# Altium schematic sheet ST_LINK_V2-1.SchDoc: ST_LINK_V2-1
size A4; CompanyName: STMicroelectronics; Organization: Microcontrollers Division; SheetNumber: 7; SheetTotal: 8
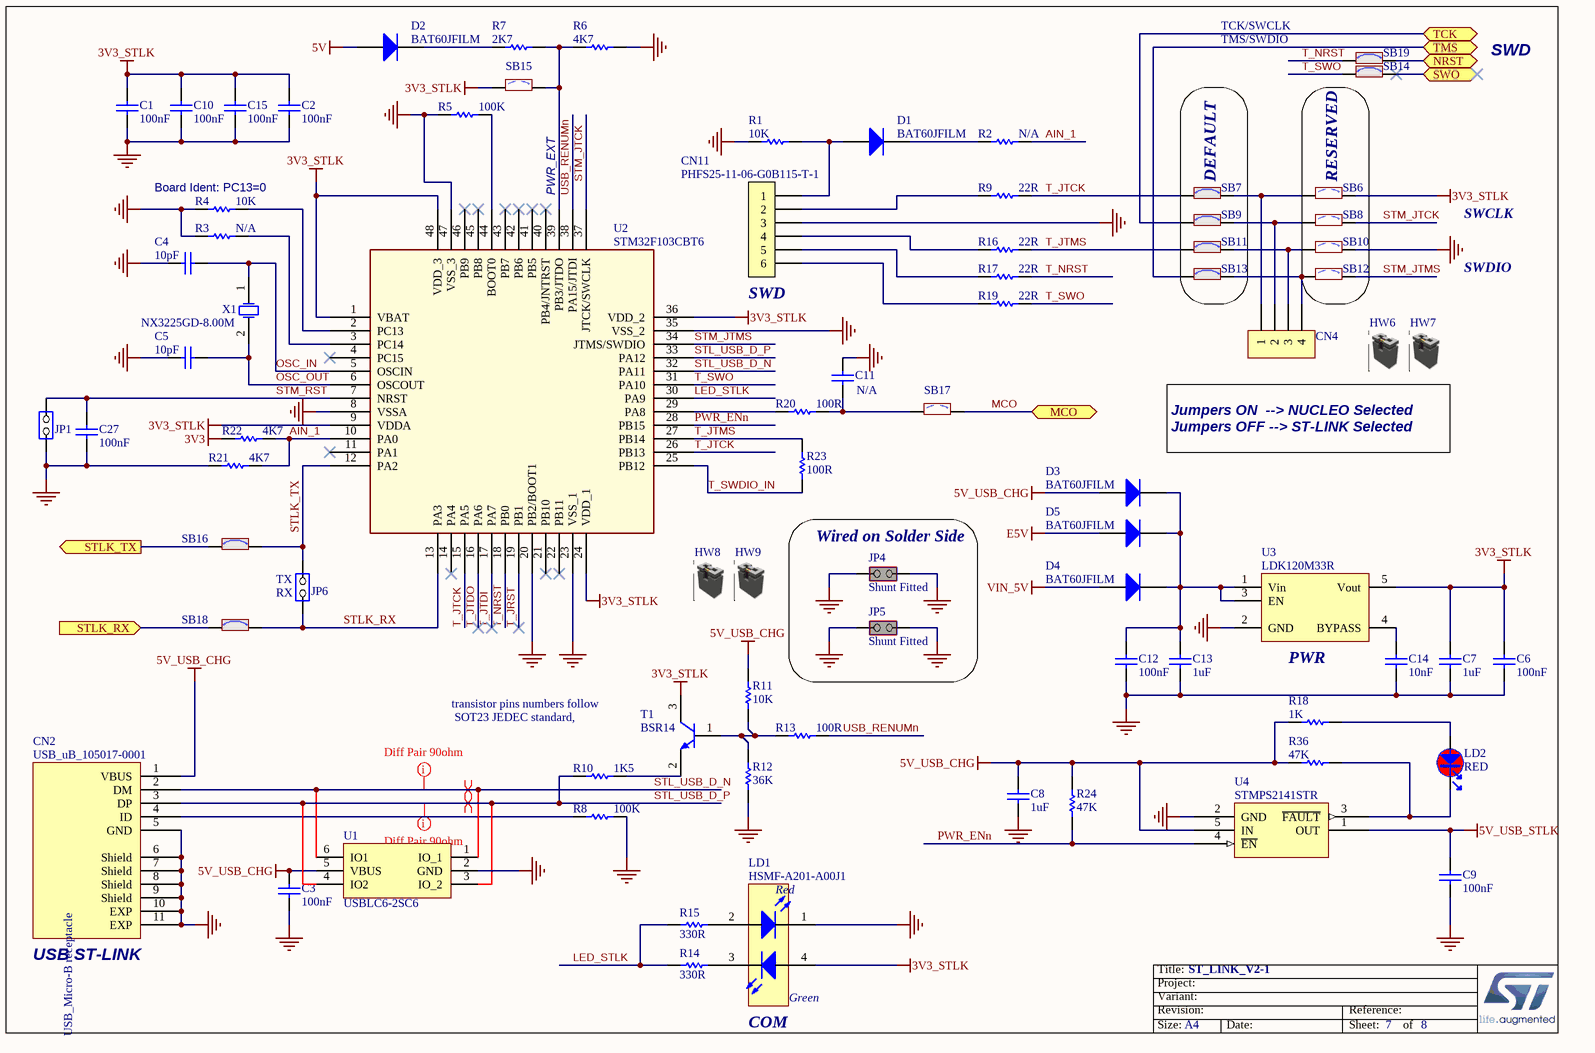
[diagram p0: ST_LINK_V2-1.SchDoc]

## Parts
C1  value 100nF  [C0603]  (hidden comment: Capacitor)
C2  value 100nF  [C0603]  (hidden comment: Capacitor)
C3  value 100nF  [C0603]  (hidden comment: Capacitor)
C4  value 10pF  [C0603]  (hidden comment: Capacitor)
C5  value 10pF  [C0603]  (hidden comment: Capacitor)
C6  value 100nF  [C0603]  (hidden comment: Capacitor)
C7  value 1uF  [C0603]  (hidden comment: Capacitor)
C8  value 1uF  [C0603]  (hidden comment: Capacitor)
C9  value 100nF  [C0603]  (hidden comment: Capacitor)
C10  value 100nF  [C0603]  (hidden comment: Capacitor)
C11  N/A  [C0603]
C12  value 100nF  [C0603]  (hidden comment: Capacitor)
C13  value 1uF  [C0603]  (hidden comment: Capacitor)
C14  value 10nF  [C0603]  (hidden comment: Capacitor)
C15  value 100nF  [C0603]  (hidden comment: Capacitor)
C27  value 100nF  [C0603]  (hidden comment: Capacitor)
CN2  value USB_uB_105017-0001  [CON_USBMICROB_MOLEX_105017-0001_H2P90]  (hidden comment: USB_uB_105017.0001)
CN4  Header 4x1  [CON_988-JIUBABA_PHFS25-11-04-G0B115-T-1]  (value not drawn)
CN11  Manufacturer_Part_Number: PHFS25-11-06-G0B115-T-1  [CON_988-JIUBABA_PHFS25-11-06-G0B115-T-1]  (hidden comment: Header 6x1)
D1  BAT60JFILM  [DIO_SOD323]
D2  BAT60JFILM  [DIO_SOD323]
D3  BAT60JFILM  [DIO_SOD323]
D4  BAT60JFILM  [DIO_SOD323]
D5  BAT60JFILM  [DIO_SOD323]
HW6  Shunt 2.54mm  [N/A]  (value not drawn)  (mechanical)
HW7  Shunt 2.54mm  [N/A]  (value not drawn)  (mechanical)
HW8  Shunt 2.54mm  [N/A]  (value not drawn)  (mechanical)
HW9  Shunt 2.54mm  [N/A]  (value not drawn)  (mechanical)
JP1  Jumper Header 2x1  [CON_SAMTEC_TSW-102-07-G-S]  (value not drawn)
JP4  Shunt Fitted  [CON_SAMTEC_TSW-102-07-G-S]
JP5  Shunt Fitted  [CON_SAMTEC_TSW-102-07-G-S]
JP6  Jumper Header 2x1  [CON_SAMTEC_TSW-102-07-G-S]  (value not drawn)
LD1  Manufacturer_Part_Number: HSMF-A201-A00J1  [LED_BI-GR_HSMF-A201-A00J1]  (hidden comment: LD_BICOLOR_CMS)
LD2  value RED  [LED_0603_RED]  (hidden comment: LED_red)
R1  value 10K  [R0603]  (hidden comment: Resistor)
R2  N/A  [R0603]
R3  N/A  [R0603]
R4  value 10K  [R0603]  (hidden comment: Resistor)
R5  value 100K  [R0603]  (hidden comment: Resistor)
R6  value 4K7  [R0603]  (hidden comment: Resistor)
R7  value 2K7  [R0603]  (hidden comment: Resistor)
R8  value 100K  [R0603]  (hidden comment: Resistor)
R9  value 22R  [R0603]  (hidden comment: Resistor)
R10  value 1K5  [R0603]  (hidden comment: Resistor)
R11  value 10K  [R0603]  (hidden comment: Resistor)
R12  value 36K  [R0603]  (hidden comment: Resistor)
R13  value 100R  [R0603]  (hidden comment: Resistor)
R14  value 330R  [R0603]  (hidden comment: Resistor)
R15  value 330R  [R0603]  (hidden comment: Resistor)
R16  value 22R  [R0603]  (hidden comment: Resistor)
R17  value 22R  [R0603]  (hidden comment: Resistor)
R18  value 1K  [R0603]  (hidden comment: Resistor)
R19  value 22R  [R0603]  (hidden comment: Resistor)
R20  value 100R  [R0603]  (hidden comment: Resistor)
R21  value 4K7  [R0603]  (hidden comment: Resistor)
R22  value 4K7  [R0603]  (hidden comment: Resistor)
R23  value 100R  [R0603]  (hidden comment: Resistor)
R24  value 47K  [R0603]  (hidden comment: Resistor)
R36  value 47K  [R0603]  (hidden comment: Resistor)
SB6  SB_OFF  [SOLDER-BRIDGE_R0603-0R]  (value not drawn)
SB7  SB_ON  [SOLDER-BRIDGE_R0603-0R]  (value not drawn)
SB8  SB_OFF  [SOLDER-BRIDGE_R0603-0R]  (value not drawn)
SB9  SB_ON  [SOLDER-BRIDGE_R0603-0R]  (value not drawn)
SB10  SB_OFF  [SOLDER-BRIDGE_R0603-0R]  (value not drawn)
SB11  SB_ON  [SOLDER-BRIDGE_R0603-0R]  (value not drawn)
SB12  SB_OFF  [SOLDER-BRIDGE_R0603-0R]  (value not drawn)
SB13  SB_ON  [SOLDER-BRIDGE_R0603-0R]  (value not drawn)
SB14  SB_ON  [SOLDER-BRIDGE_R0603-0R]  (value not drawn)
SB15  SB_OFF  [SOLDER-BRIDGE_R0603-0R]  (value not drawn)
SB16  SB_ON  [SOLDER-BRIDGE_R0603-0R]  (value not drawn)
SB17  SB_OFF  [SOLDER-BRIDGE_R0603-0R]  (value not drawn)
SB18  SB_ON  [SOLDER-BRIDGE_R0603-0R]  (value not drawn)
SB19  SB_ON  [SOLDER-BRIDGE_R0603-0R]  (value not drawn)
T1  Manufacturer_Part_Number: BSR14  [NPN_SOT23]  (hidden comment: 9013-SOT23)
U1  USBLC6-2SC6  [ESD_SOT23-6L]
U2  STM32F103CBT6  [ICC_LQFP48_7X7_P050]
U3  LDK120M33R  [REG_SOT23-5L]
U4  value STMPS2141STR  [MOS_SOT23-5L]  (hidden comment: DFN8 and SO8 are mixed in a single footprint allowing to swap according to components availability)
X1  value NX3225GD-8.00M  [CRY_NX3225GD_2P]  (hidden comment: XTAL_8M_NX3225GD)

## Blocks framed on the sheet
DEFAULT: SB7 SB9 SB11 SB13
RESERVED: SB6 SB8 SB10 SB12
Wired on Solder Side: JP4 JP5

## Ports
MCO, NRST, STLK_RX (in), STLK_TX (out), SWO, TCK, TMS

## Nets
3V3: R22.1
3V3_STLK: C1.2 C2.2 C6.2 C7.2 C10.2 C15.2 LD1.4(YellowGreen_anode) SB6.2 SB15.1 T1.3(C) U2.1(VBAT) U2.9(VDDA) U2.24(VDD_1) U2.36(VDD_2) U2.48(VDD_3) U3.5(Vout)
5V: D2.1(A)
5V_USB_CHG: C3.2 C8.1 CN2.1(VBUS) D3.1(A) R11.2 R18.2 R24.2 R36.2 U1.5(VBUS) U4.5(IN)
5V_USB_STLK: C9.2 U4.1(OUT)
E5V: D5.1(A)
GND: C1.1 C2.1 C3.1 C4.1 C5.1 C6.1 C7.1 C8.2 C9.1 C10.1 C11.2 C12.1 C13.1 C14.1 C15.1 C27.2 CN2.5(GND) CN2.6(Shield) CN2.7(Shield) CN2.8(Shield) CN2.9(Shield) CN2.10(EXP) CN2.11(EXP) CN11.3 JP1.2(NO) JP4.1(COMMON) JP4.2(NO) JP5.1(COMMON) JP5.2(NO) LD1.1(RED_cathode) R1.2 R3.1 R4.1 R5.1 R6.2 R8.2 R12.1 R21.1 SB10.2 U1.2(GND) U2.8(VSSA) U2.20(PB2/BOOT1) U2.23(VSS_1) U2.35(VSS_2) U2.47(VSS_3) U3.2(GND) U4.2(GND)
VIN_5V: D4.1(A)
AIN_1: R2.2 R21.2 R22.2 U2.10(PA0)
LED_STLK: R14.1 R15.1 U2.30(PA9)
MCO: SB17.2 ; port MCO
NRST: SB19.2 ; port NRST
OSC_IN: C4.2 U2.5(OSCIN) X1.1(OSC1)
OSC_OUT: C5.2 U2.6(OSCOUT) X1.2(OSC2)
PWR_ENn: R24.1 U2.28(PB15) U4.4(~{EN})
STL_USB_D_N: CN2.2(DM) U1.1(IO_1) U1.6(IO1) U2.32(PA11)
STL_USB_D_P: CN2.3(DP) R10.1 U1.3(IO_2) U1.4(IO2) U2.33(PA12)
STLK_RX: JP6.1(COMMON) SB18.2 U2.13(PA3)
STLK_RX: SB18.1 ; port STLK_RX  [a separate net that carries the same name]
STLK_TX: JP6.2(NO) SB16.2 U2.12(PA2)
STLK_TX: SB16.1 ; port STLK_TX  [a separate net that carries the same name]
STM_JTCK: SB8.2 U2.37(JTCK/SWCLK)
STM_JTMS: SB12.2 U2.34(JTMS/SWDIO)
STM_RST: C27.1 JP1.1(COMMON) U2.7(NRST)
SWO: SB14.2 ; port SWO
T_JRST: U2.19(PB1)
T_JTCK: R9.2 SB7.1 U2.15(PA5) U2.26(PB13)
T_JTDI: U2.17(PA7)
T_JTDO: U2.16(PA6)
T_JTMS: R16.2 R23.2 SB11.1 U2.27(PB14)
T_NRST: R17.2 SB19.1 U2.18(PB0)
T_SWDIO_IN: R23.1 U2.25(PB12)
T_SWO: R19.2 SB14.1 U2.31(PA10)
TCK: SB9.1 ; port TCK
TMS: SB13.1 ; port TMS
USB_RENUMn: R13.2 U2.38(PA15/JTDI)
NetC11_1: C11.1 R20.2 SB17.1
NetC12_2: C12.2 C13.2 D3.2(K) D4.2(K) D5.2(K) U3.1(Vin) U3.3(EN)
NetC14_2: C14.2 U3.4(BYPASS)
NetCN2_4: CN2.4(ID) R8.1
NetCN4_1: CN4.1 SB6.1 SB7.2
NetCN4_2: CN4.2 SB8.1 SB9.2
NetCN4_3: CN4.3 SB10.1 SB11.2
NetCN4_4: CN4.4 SB12.1 SB13.2
NetCN11_1: CN11.1 D1.1(A) R1.1
NetCN11_2: CN11.2 R9.1
NetCN11_4: CN11.4 R16.1
NetCN11_5: CN11.5 R17.1
NetCN11_6: CN11.6 R19.1
NetD1_2: D1.2(K) R2.1
NetD2_2: D2.2(K) R7.1
NetLD1_2: LD1.2(Red_anode) R15.2
NetLD1_3: LD1.3(YellowGreen_cathode) R14.2
NetLD2_1: LD2.1 R18.1
NetLD2_2: LD2.2 R36.1 U4.3(~{FAULT})
NetR3_2: R3.2 U2.3(PC14)
NetR4_2: R4.2 U2.2(PC13)
NetR5_2: R5.2 U2.44(BOOT0)
NetR6_1: R6.1 R7.2 SB15.2 U2.39(PB3/JTDO)
NetR10_2: R10.2 T1.2(E)
NetR11_1: R11.1 R12.2 R13.1 T1.1(B)
NetR20_1: R20.1 U2.29(PA8)

Not connected (* = marked no-connect by the designer): U2 4(PC15)* 11(PA1)* 14(PA4)* 21(PB10)* 22(PB11)* 40(PB4/JNTRST)* 41(PB5)* 42(PB6)* 43(PB7)* 45(PB8)* 46(PB9)*

## Layout directives
mark named Diff Pair 90ohm: STL_USB_D_N, STL_USB_D_P
differential pair: STL_USB_D_N, STL_USB_D_P

## Notes on the sheet
- TCK/SWCLK
- TMS/SWDIO
- SWD
- (near R4) Board Ident: PC13=0
- PWR_EXT
- SWCLK
- (near CN11) SWD
- SWDIO
- Jumpers ON  --> NUCLEO Selected
  Jumpers OFF --> ST-LINK Selected
- (near JP6) TX
- (near JP6) RX
- (near U3) PWR
- (near T1) transistor pins numbers follow
  SOT23 JEDEC standard,
- (near CN2) USB ST-LINK
- COM
- Title:
- Project:
- Size:
- Revision:
- Variant:
- A4
- Date:
- Reference:
- Sheet:
- of
- (in symbol MCD-00028) USB_Micro-B receptacle
- (in symbol MCD-00051) Red; Green

## Library data of the parts
C1-C3 C6 C9 C10 C12 C15 C27 = MCD-00211: Capacitor, MLCC, 100nF, 16V, X7R, 10%, 0603, T=0,8mm; Manufacturer_Part_Number: CC0603KRX7R7BB104; Manufacturer: YAGEO; Provided_By: Subcon; Initial_Board_Reference: mb1319; Internal_Part_Number: MCD-00211; Status: Released; Part_Type: Capacitor; Package: C0603; ComponentLink1Description: Yageo_Capacitor_X7R-series.pdf; ComponentLink1URL: http://tunmcdsvn.tun.st.com/Component_Datasheet_Library/Trunk/Capacitors/Yageo_Capacitor_X7R-series.pdf; ECCN_US: n/a; ECCN_EU: n/a
C4 C5 = MCD-00637: Capacitor, MLCC, 10pF, 50V, NPO, 5%, 0603, T=0,8mm; Manufacturer_Part_Number: CC0603JRNPO9BN100; Manufacturer: YAGEO; Provided_By: subcon; Initial_Board_Reference: mb1319; Internal_Part_Number: MCD-00637; Status: Released; Part_Type: Capacitor; Package: C0603; ComponentLink1Description: Yageo_Capacitor_NP0_16V-to-50V.pdf; ComponentLink1URL: http://tunmcdsvn.tun.st.com/Component_Datasheet_Library/Trunk/Capacitors/Yageo_Capacitor_NP0_16V-to-50V.pdf; ECCN_US: n/a; ECCN_EU: n/a
C7 C13 = MCD-00010: Capacitor, MLCC, 1uF, 16V, X5R, 10%, 0603, T=0,8mm; Manufacturer_Part_Number: CC0603KRX5R7BB105; Manufacturer: YAGEO; Provided_By: Subcon; Initial_Board_Reference: mb1274; Internal_Part_Number: MCD-00010; Status: Released; Part_Type: Capacitor; Package: C0603; ComponentLink1Description: Yageo_Capacitor_X5R-series.pdf; ComponentLink1URL: http://tunmcdsvn.tun.st.com/Component_Datasheet_Library/Trunk/Capacitors/Yageo_Capacitor_X5R-series.pdf; ECCN_US: n/a; ECCN_EU: n/a
C8 = MCD-00238: Capacitor, MLCC, 1uF, 6V3, X5R, 10%, 0603, T=0,8mm; Manufacturer_Part_Number: CC0603KRX5R5BB105; Manufacturer: YAGEO; Provided_By: Subcon; Initial_Board_Reference: mb1319; Internal_Part_Number: MCD-00238; ECCN_US: n/a; ECCN_EU: n/a; ComponentLink1Description: Yageo_Capacitor_X5R-series.pdf; Status: Released; Part_Type: Capacitor; Package: C0603; ComponentLink1URL: http://tunmcdsvn.tun.st.com/Component_Datasheet_Library/Trunk/Capacitors/Yageo_Capacitor_X5R-series.pdf
C11 = MCD-00638: Capacitor, MLCC, 20pF, 50V, NPO, 5%, 0603, T=0,8mm; Manufacturer_Part_Number: CC0603JRNPO9BN200; Manufacturer: YAGEO; Provided_By: Subcon; Initial_Board_Reference: mb1319; Internal_Part_Number: MCD-00638; Value: 20pF; Status: Released; Part_Type: Capacitor; Package: C0603; ComponentLink1Description: Yageo_Capacitor_NP0_16V-to-50V.pdf; ECCN_US: n/a; ECCN_EU: n/a; ComponentLink1URL: http://tunmcdsvn.tun.st.com/Component_Datasheet_Library/Trunk/Capacitors/Yageo_Capacitor_NP0_16V-to-50V.pdf
C14 = MCD-00017: Capacitor, MLCC, 10nF, 50V, X7R, 10%, 0603, T=0.8mm; Manufacturer_Part_Number: CC0603KRX7R9BB103; Manufacturer: YAGEO; Provided_By: Subcon; Initial_Board_Reference: mb1274; Internal_Part_Number: MCD-00017; Status: Released; Part_Type: Capacitor; Package: C0603; ComponentLink1Description: Yageo_Capacitor_X7R-series.pdf; ComponentLink1URL: http://tunmcdsvn.tun.st.com/Component_Datasheet_Library/Trunk/Capacitors/Yageo_Capacitor_X7R-series.pdf; ECCN_US: n/a; ECCN_EU: n/a
CN2 = MCD-00028: USB-MICRO-B, 0.65mm, RA, SMT, Bottom Mount,; Part_Type: Connector; Manufacturer_Part_Number: 1050170001; Manufacturer: MOLEX; Provided_By: Subcon; Initial_Board_Reference: mb1274; Internal_Part_Number: MCD-00028; Status: Released; ComponentLink1Description: Molex_Connector-USB-microB_105017-0001.pdf; ComponentLink1URL: http://tunmcdsvn.tun.st.com/Component_Datasheet_Library/Trunk/Connectors/Molex_Connector-USB-microB_105017-0001.pdf; ECCN_US: n/a; ECCN_EU: n/a
CN4 = MCD-00313: Header, 4x1, 2.54mm, VR, TH, Height 6mm/3mm; Part_Type: Connector; Manufacturer_Part_Number: PHFS25-11-04-G0B115-T-1; Manufacturer: JIUBABA; Provided_By: Subcon; Initial_Board_Reference: mb1311; Internal_Part_Number: MCD-00313; Value: Header 4x1; Status: Released; ComponentLink1Description: Juibaba_PHFS25-11XXXXXXXXXX.pdf; ComponentLink1URL: http://tunmcdsvn.tun.st.com/Component_Datasheet_Library/Trunk/Connectors/Juibaba_PHFS25-11XXXXXXXXXX.pdf; ECCN_US: n/a; ECCN_EU: n/a
CN11 = MCD-00316: Header, 6x1, 2.54mm, VR, TH, Height 6mm/3mm; Part_Type: Connector; Manufacturer: JIUBABA; Value: Header 1x6; Provided_By: Subcon; Initial_Board_Reference: mb1311; Internal_Part_Number: MCD-00316; Status: Released; ComponentLink1Description: Juibaba_PHFS25-11XXXXXXXXXX.pdf; ComponentLink1URL: http://tunmcdsvn.tun.st.com/Component_Datasheet_Library/Trunk/Connectors/Juibaba_PHFS25-11XXXXXXXXXX.pdf; ECCN_US: n/a; ECCN_EU: n/a
D1 D3-D5 = MCD-00034: Part_Type: Diode; Manufacturer: STMICROELECTRONICS; ECCN_US: EAR99; ECCN_EU: NEC; Provided_By: Subcon; Initial_Board_Reference: mb1274; Internal_Part_Number: MCD-00034; Value: BAT60JFILM; Status: Released; Manufacturer_Part_Number: BAT60JFILM; ComponentLink1Description: STM_Diode_BAT60JFILM-SOD323.pdf; ComponentLink1URL: http://tunmcdsvn.tun.st.com/Component_Datasheet_Library/Trunk/Diodes/STM_Diode_BAT60JFILM-SOD323.pdf
D2 = MCD-00034: Manufacturer: STMICROELECTRONICS; Part_Type: Diode; ECCN_US: EAR99; ECCN_EU: NEC; Provided_By: Subcon; Initial_Board_Reference: mb1274; Internal_Part_Number: MCD-00034; Value: BAT60JFILM; Manufacturer_Part_Number: BAT60JFILM; ComponentLink1Description: STM_Diode_BAT60JFILM-SOD323.pdf; Status: Released
HW6-HW9 = MCD-00043: SHUNT 2.54mm BLACK; Manufacturer_Part_Number: SNT-100-BK-G; Manufacturer: SAMTEC; Provided_By: Subcon; Internal_Part_Number: MCD-00043; PartType: Mechanical; ECCN_US: n/a; ECCN_EU: n/a; ComponentLink1Description: Samtec_Shunt_Jumper_SNT100.pdf
JP1 JP6 = MCD-00045: Header, 2x1, 2,54mm, VR, TH, Height 5.84mm/2.54mm; Part_Type: Connector; Manufacturer_Part_Number: TSW-102-07-x-S; Manufacturer: SAMTEC; Value: Jumper_Header_2x1; Provided_By: Subcon; Initial_Board_Reference: mb1274; Internal_Part_Number: MCD-00045; Status: Released; ComponentLink1Description: Samtec_connector_TSW-HTSW-series.pdf; ComponentLink1URL: http://tunmcdsvn.tun.st.com/Component_Datasheet_Library/Trunk/Connectors/Samtec_connector_TSW-HTSW-series.pdf; ECCN_US: n/a; ECCN_EU: n/a
JP4 JP5 = MCD-00683: Header, 2x1, 2,54mm, VR, TH, Height 5.84mm/2.54mm - Shunt Fitted by default; Part_Type: Connector; Manufacturer_Part_Number: TSW-102-07-x-S; Manufacturer: SAMTEC; Provided_By: Subcon; Initial_Board_Reference: MB1331; Internal_Part_Number: MCD-00683; Value: Shunt Fitted; Status: Released; ComponentLink1Description: Samtec_connector_TSW-HTSW-series.pdf; ComponentLink1URL: http://tunmcdsvn.tun.st.com/Component_Datasheet_Library/Trunk/Connectors/Samtec_TSW-HTSW-series; ECCN_US: n/a; ECCN_EU: n/a
LD1 = MCD-00051: LED Bicolor; Part_Type: Display; Manufacturer: AVAGO TECHNOLOGIES; Alternate_Manufacturer_Part_Number: LE-RGW35280; Alternate_Manufacturer: EVERLUCK; ECCN_US: EAR99; ECCN_EU: NEC; Provided_By: Subcon; Initial_Board_Reference: mb1274; Internal_Part_Number: MCD-00051; Value: LD_BICOLOR_CMS; Status: Released; ComponentLink1Description: Avago_LED-SMC_HSMx-A2xx-02Feb2012.pdf; ComponentLink1URL: http://tunmcdsvn.tun.st.com/Component_Datasheet_Library/Trunk/display/Avago_LED-SMC_HSMx-A2xx-02Feb2012.pdf
LD2 = MCD-00049: LED, Red, 0603; Manufacturer_Part_Number: 19-213-R6C-AP1Q2B/3T; Manufacturer: EVERLIGHT; Part_Type: Display; ECCN_US: EAR99; ECCN_EU: NEC; Provided_By: Subcon; Initial_Board_Reference: mb1274; Internal_Part_Number: MCD-00049; ComponentLink1Description: Everlight_SMD-LED-RED_19-213-R6C-AP1Q2B-3T-V3.doc.pdf; Status: Released; ComponentLink1URL: http://tunmcdsvn.tun.st.com/Component_Datasheet_Library/Trunk/display/Everlight_SMD-LED-RED_19-213-R6C-AP1Q2B-3T-V3.doc.pdf
R1 R3 R4 R11 = MCD-00220: Resistor,10K,0603,1%,1/10W; Manufacturer_Part_Number: RC0603FR-0710KL; Manufacturer: YAGEO; Provided_By: Subcon; Initial_Board_Reference: mb1319; Internal_Part_Number: MCD-00220; Status: Released; Part_Type: Resistor; Package: R0603; ComponentLink1Description: Yageo_Resistor_RC0603-series.pdf; ComponentLink1URL: http://tunmcdsvn.tun.st.com/Component_Datasheet_Library/Trunk/Resistors/Yageo_Resistor_RC0603-series.pdf; ECCN_US: n/a; ECCN_EU: n/a
  R3: Value: 10K
R2 R9 R16 R17 R19 = MCD-00066: Resistor,22R,0603,1%,1/10W; Manufacturer_Part_Number: RC0603FR-0722RL; Manufacturer: YAGEO; Provided_By: Subcon; Initial_Board_Reference: mb1274; Internal_Part_Number: MCD-00066; Status: Released; Part_Type: Resistor; Package: R0603; ComponentLink1Description: Yageo_Resistor_RC0603-series.pdf; ComponentLink1URL: http://tunmcdsvn.tun.st.com/Component_Datasheet_Library/Trunk/Resistors/Yageo_Resistor_RC0603-series.pdf; ECCN_US: n/a; ECCN_EU: n/a
  R2: Value: 22R
R5 R8 = MCD-00223: Resistor,100K,0603,1%,1/10W; Manufacturer_Part_Number: RC0603FR-07100KL; Manufacturer: YAGEO; Provided_By: Subcon; Initial_Board_Reference: mb1319; Internal_Part_Number: MCD-00223; Status: Released; Part_Type: Resistor; Package: R0603; ComponentLink1Description: Yageo_Resistor_RC0603-series.pdf; ComponentLink1URL: http://tunmcdsvn.tun.st.com/Component_Datasheet_Library/Trunk/Resistors/Yageo_Resistor_RC0603-series.pdf; ECCN_US: n/a; ECCN_EU: n/a
R6 R21 R22 = MCD-00219: Resistor,4K7,0603,1%,1/10W; Manufacturer_Part_Number: RC0603FR-074K7L; Manufacturer: YAGEO; Provided_By: Subcon; Initial_Board_Reference: mb1319; Internal_Part_Number: MCD-00219; Status: Released; Part_Type: Resistor; Package: R0603; ComponentLink1Description: Yageo_Resistor_RC0603-series.pdf; ComponentLink1URL: http://tunmcdsvn.tun.st.com/Component_Datasheet_Library/Trunk/Resistors/Yageo_Resistor_RC0603-series.pdf; ECCN_US: n/a; ECCN_EU: n/a
R7 = MCD-00218: Resistor,2K7,0603,1%,1/10W; Manufacturer_Part_Number: RC0603FR-072K7L; Manufacturer: YAGEO; Provided_By: Subcon; Initial_Board_Reference: mb1319; Internal_Part_Number: MCD-00218; Status: Released; Part_Type: Resistor; Package: R0603; ComponentLink1Description: Yageo_Resistor_RC0603-series.pdf; ComponentLink1URL: http://tunmcdsvn.tun.st.com/Component_Datasheet_Library/Trunk/Resistors/Yageo_Resistor_RC0603-series.pdf; ECCN_US: n/a; ECCN_EU: n/a
R10 = MCD-00217: Resistor,1K5,0603,1%,1/10W; Manufacturer_Part_Number: RC0603FR-071K5L; Manufacturer: YAGEO; Provided_By: Subcon; Initial_Board_Reference: mb1319; Internal_Part_Number: MCD-00217; Status: Released; Part_Type: Resistor; Package: R0603; ComponentLink1Description: Yageo_Resistor_RC0603-series.pdf; ComponentLink1URL: http://tunmcdsvn.tun.st.com/Component_Datasheet_Library/Trunk/Resistors/Yageo_Resistor_RC0603-series.pdf; ECCN_US: n/a; ECCN_EU: n/a
R12 = MCD-00221: Resistor,36K,0603,1%,1/10W; Manufacturer_Part_Number: RC0603FR-0736KL; Manufacturer: YAGEO; Provided_By: Subcon; Initial_Board_Reference: mb1319; Internal_Part_Number: MCD-00221; Status: Released; Part_Type: Resistor; Package: R0603; ComponentLink1Description: Yageo_Resistor_RC0603-series.pdf; ComponentLink1URL: http://tunmcdsvn.tun.st.com/Component_Datasheet_Library/Trunk/Resistors/Yageo_Resistor_RC0603-series.pdf; ECCN_US: n/a; ECCN_EU: n/a
R13 R20 R23 = MCD-00224: Resistor,100R,0603,1%,1/10W; Manufacturer_Part_Number: RC0603FR-07100RL; Manufacturer: YAGEO; Provided_By: Subcon; Initial_Board_Reference: mb1319; Internal_Part_Number: MCD-00224; Status: Released; Part_Type: Resistor; Package: R0603; ComponentLink1Description: Yageo_Resistor_RC0603-series.pdf; ComponentLink1URL: http://tunmcdsvn.tun.st.com/Component_Datasheet_Library/Trunk/Resistors/Yageo_Resistor_RC0603-series.pdf; ECCN_US: n/a; ECCN_EU: n/a
R14 R15 = MCD-00197: Resistor,330R,0603,1%,1/10W; Manufacturer_Part_Number: RC0603FR-07330RL; Manufacturer: YAGEO; Provided_By: Subcon; Internal_Part_Number: MCD-00197; Status: Released; Part_Type: Resistor; Package: R0603; ComponentLink1Description: Yageo_Resistor_RC0603-series.pdf; ComponentLink1URL: http://tunmcdsvn.tun.st.com/Component_Datasheet_Library/Trunk/Resistors/Yageo_Resistor_RC0603-series; ECCN_US: n/a; ECCN_EU: n/a
R18 = MCD-00070: Resistor,1K,0603,1%,1/10W; Manufacturer_Part_Number: RC0603FR-071KL; Manufacturer: YAGEO; Provided_By: Subcon; Initial_Board_Reference: mb1274; Internal_Part_Number: MCD-00070; Status: Released; Part_Type: Resistor; Package: R0603; ComponentLink1Description: Yageo_Resistor_RC0603-series.pdf; ComponentLink1URL: http://tunmcdsvn.tun.st.com/Component_Datasheet_Library/Trunk/Resistors/Yageo_Resistor_RC0603-series.pdf; ECCN_US: n/a; ECCN_EU: n/a
R24 R36 = MCD-00222: Resistor,47K,0603,1%,1/10W; Manufacturer_Part_Number: RC0603FR-0747KL; Manufacturer: YAGEO; Provided_By: Subcon; Initial_Board_Reference: MB1319; Internal_Part_Number: MCD-00222; Status: Released; Part_Type: Resistor; Package: R0603; ComponentLink1Description: Yageo_Resistor_RC0603-series.pdf; ComponentLink1URL: http://tunmcdsvn.tun.st.com/Component_Datasheet_Library/Trunk/Resistors/Yageo_Resistor_RC0603-series; ECCN_US: n/a; ECCN_EU: n/a
SB6 SB8 SB10 SB12 SB15 SB17 = MCD-00072: Solder Bridge OFF; Part_Type: Mechanical; Initial_Board_Reference: mb1274; Internal_Part_Number: MCD-00072; Status: Released; ECCN_US: n/a; ECCN_EU: n/a; Provided_By: n/a
SB7 SB9 SB11 SB13 SB14 SB16 SB18 SB19 = MCD-00071: Solder Bridge ON; Part_Type: Mechanical; Provided_By: Subcon; Initial_Board_Reference: mb1274; Internal_Part_Number: MCD-00071; ECCN_US: n/a; ECCN_EU: n/a; Status: Released
T1 = MCD-00073: NPN Bipolar Transistor; Part_Type: IC; Manufacturer: NXP; ECCN_US: EAR99; ECCN_EU: NEC; Provided_By: Subcon; Initial_Board_Reference: mb1274; Revision: *; Internal_Part_Number: MCD-00073; Value: 9013-SOT23; Status: Released; ComponentLink1Description: NXP_Transistor_BSR14.pdf; ComponentLink1URL: http://tunmcdsvn.tun.st.com/Component_Datasheet_Library/Trunk/IC/NXP_Transistor_BSR14.pdf
U1 = MCD-00163: Very low capacitance ESD protection; Part_Type: IC; Manufacturer: STMICROELECTRONICS; ECCN_US: EAR99; ECCN_EU: NEC; Provided_By: Subcon; Initial_Board_Reference: mb1263; Internal_Part_Number: MCD-00163; Value: USBLC6-2SC6; Status: Released; Manufacturer_Part_Number: USBLC6-2SC6; ComponentLink1Description: STM_ESD_USBLC6-2.pdf; ComponentLink1URL: http://tunmcdsvn.tun.st.com/Component_Datasheet_Library/Trunk/Diodes/STM_ESD_USBLC6-2.pdf
U2 = MCD-00085: Medium-density performance line ARM-based 32-bit MCU with 128KB Flash; Manufacturer: STMICROELECTRONICS; Part_Type: IC; ECCN_US: 3A991A2; ECCN_EU: NEC; Provided_By: Subcon; Initial_Board_Reference: mb1274; Value: STM32F103CBT6; Internal_Part_Number: MCD-00085; Manufacturer_Part_Number: STM32F103CBT6; ComponentLink1Description: STM_STM32F103CBT6.pdf; Status: Released; ComponentLink1URL: http://tunmcdsvn.tun.st.com/Component_Datasheet_Library/Trunk/IC/STM_STM32F103CBT6.pdf
U3 = MCD-00663: 200 mA low quiescent current very low noise LDO; Part_Type: IC; Manufacturer: STMICROELECTRONICS; ECCN_US: EAR99; ECCN_EU: NEC; Provided_By: Subcon; Initial_Board_Reference: MB1360; Internal_Part_Number: MCD-00663; Value: LDK120M33R; Status: Footprint available; Manufacturer_Part_Number: LDK120M33R; Package: SOT23-5L; ComponentLink1Description: STM_LDO_LDK120M33R.pdf; ComponentLink1URL: http://tunmcdsvn.tun.st.com/Component_Datasheet_Library/Trunk/IC/STM_LDO_LDK120M33R.pdf
U4 = MCD-00083: Enhanced single channel power switches; Part_Type: IC; Manufacturer: STMICROELECTRONICS; ECCN_US: EAR99; ECCN_EU: NEC; Provided_By: Subcon; Initial_Board_Reference: MB1274; Internal_Part_Number: MCD-00083; Status: Released; Manufacturer_Part_Number: STMPS2141STR; ComponentLink1Description: STM_PWR-Switch_STMPS2141STR.pdf; ComponentLink1URL: http://tunmcdsvn.tun.st.com/Component_Datasheet_Library/Trunk/IC/STM_PWR-Switch_STMPS2141STR
X1 = MCD-00092: Crystal 8Mhz, 8pF, -+50PPM, SMD; Part_Type: Crystal_Osc; Manufacturer_Part_Number: NX3225GD 8MHz EXS00A-CG04874; Manufacturer: NDK; ECCN_US: EAR99; ECCN_EU: NEC; Provided_By: STM; Initial_Board_Reference: mb1274; Internal_Part_Number: MCD-00092; Status: Released; ComponentLink1Description: NDK_Crystal-For-ST_NX3225GD 8MHz EXS00A-CG04874 (EXS10B-20725).pdf; ComponentLink1URL: http://tunmcdsvn.tun.st.com/Component_Datasheet_Library/Trunk/Crystal_Osc/NDK_Crystal-For-ST_NX3225GD 8MHz EXS00A-CG04874 (EXS10B-20725).pdf